# Altium schematic sheet LED Matrix.SchDoc
size A2
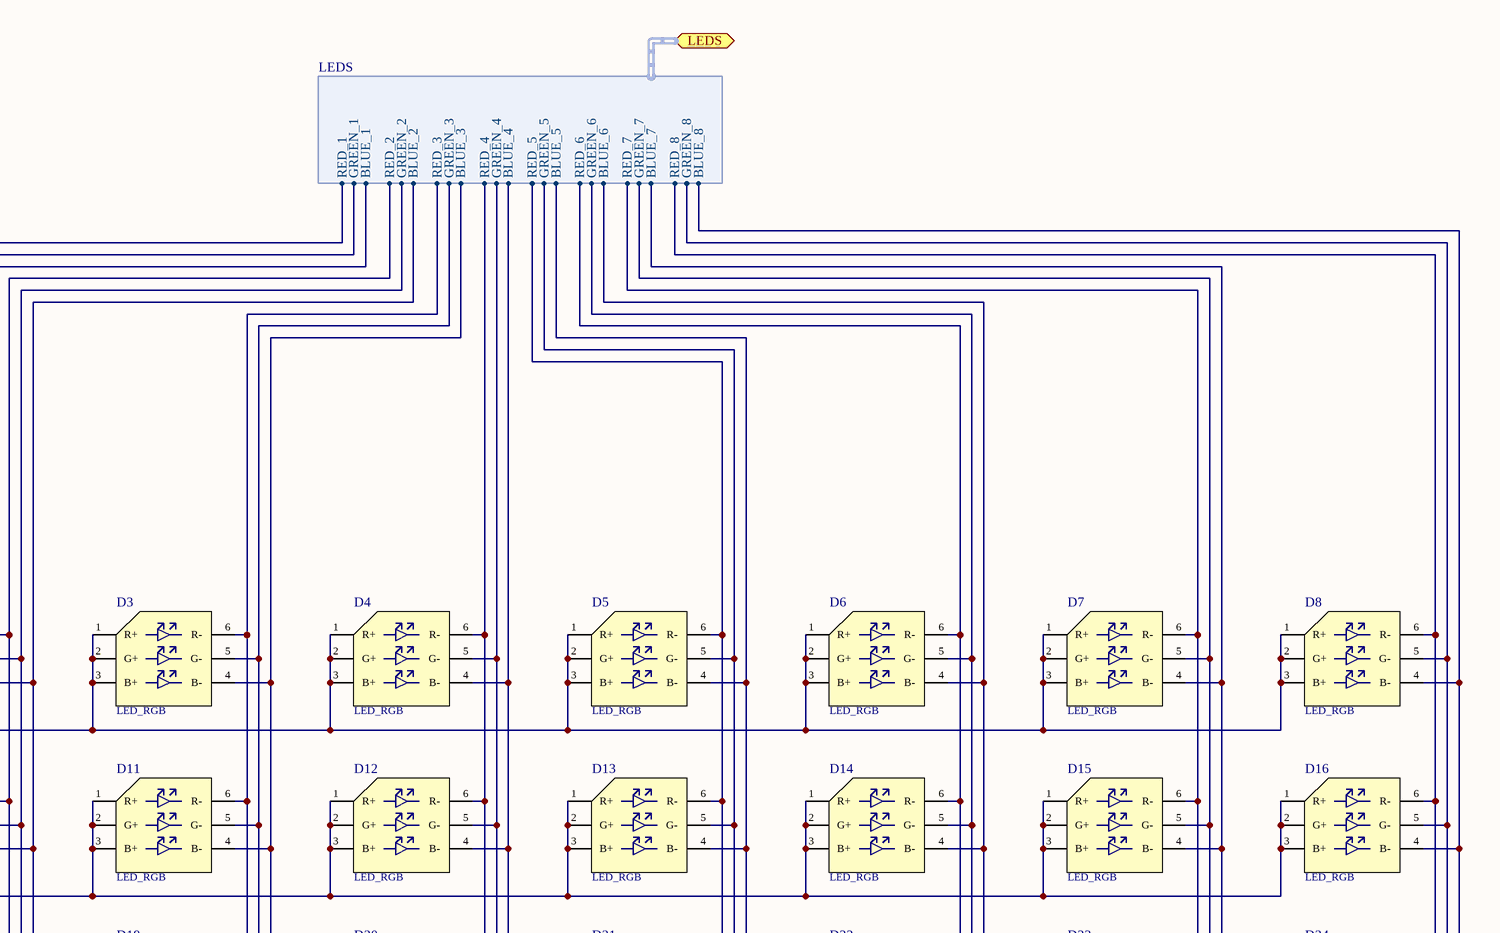
[diagram p0: LED Matrix.SchDoc, top right]
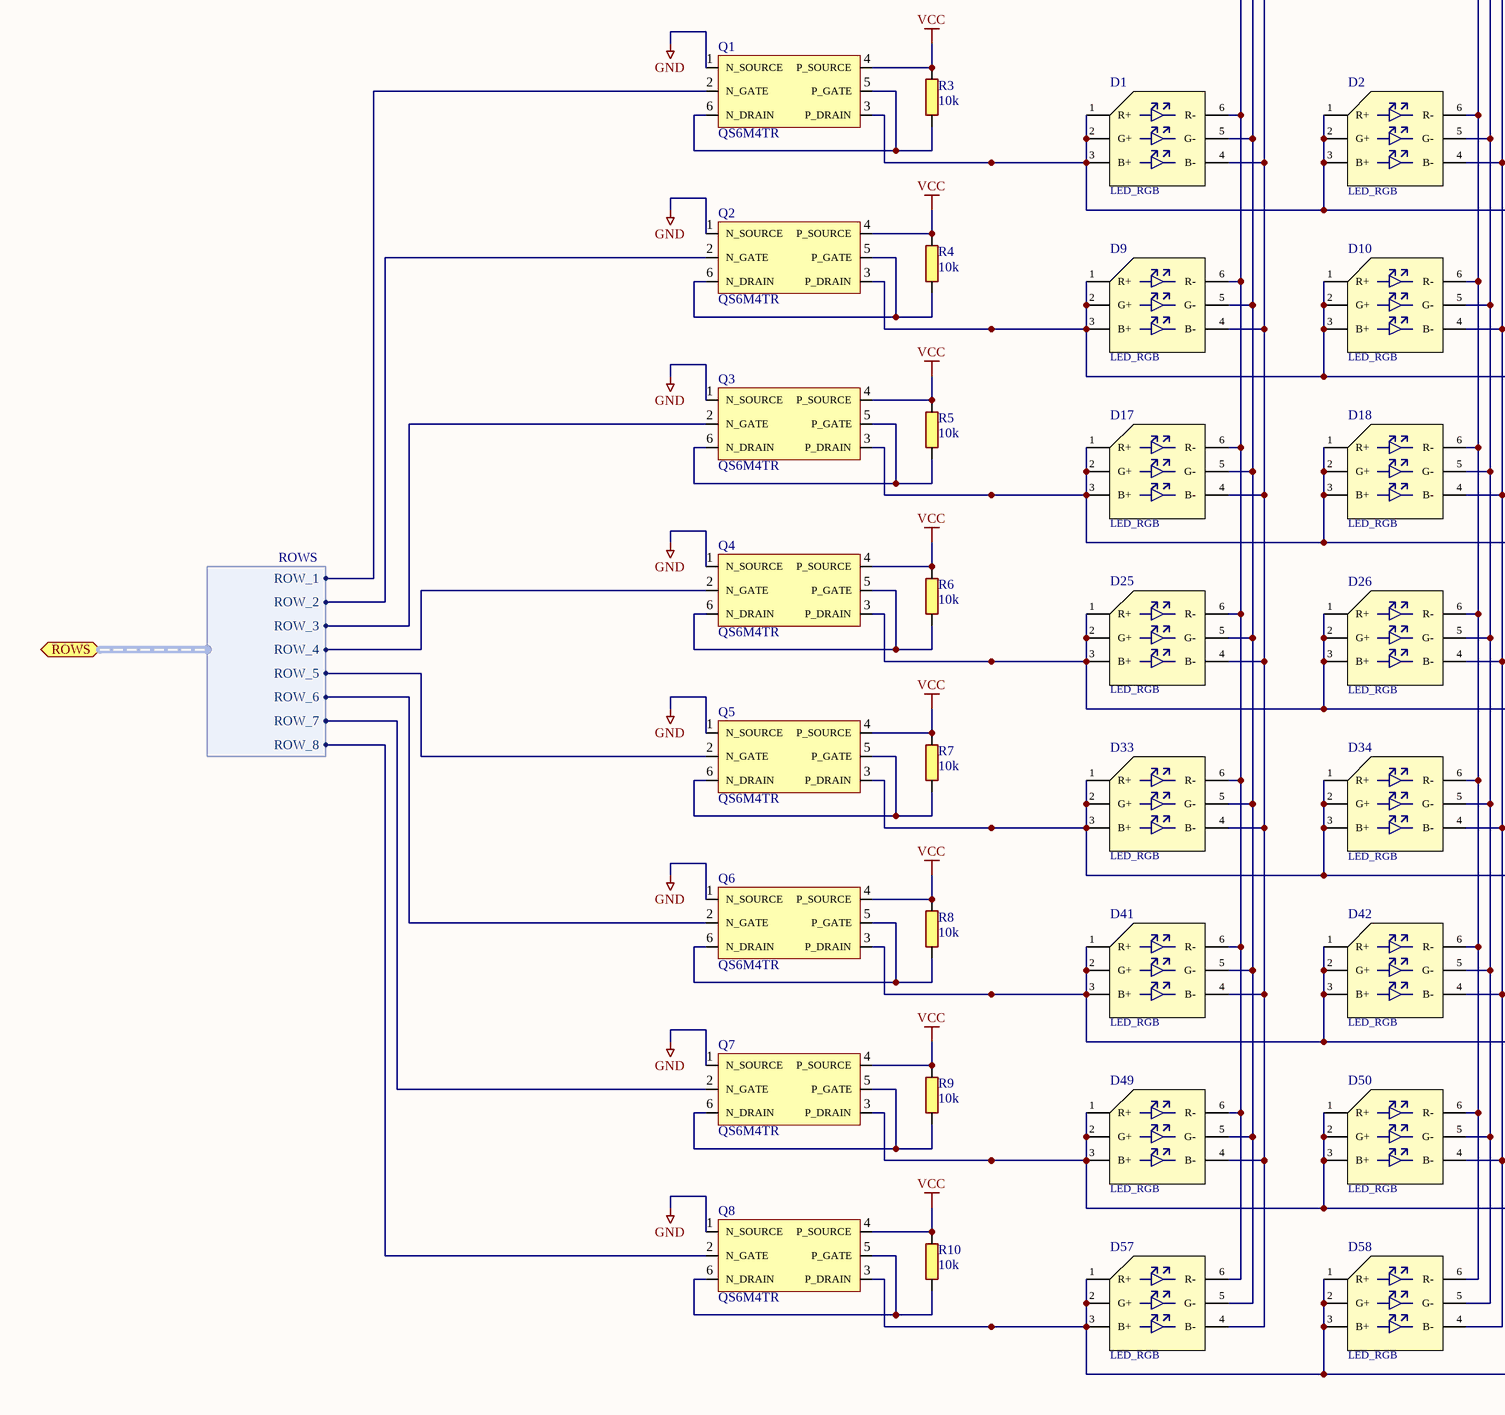
[diagram p1: LED Matrix.SchDoc, bottom left]
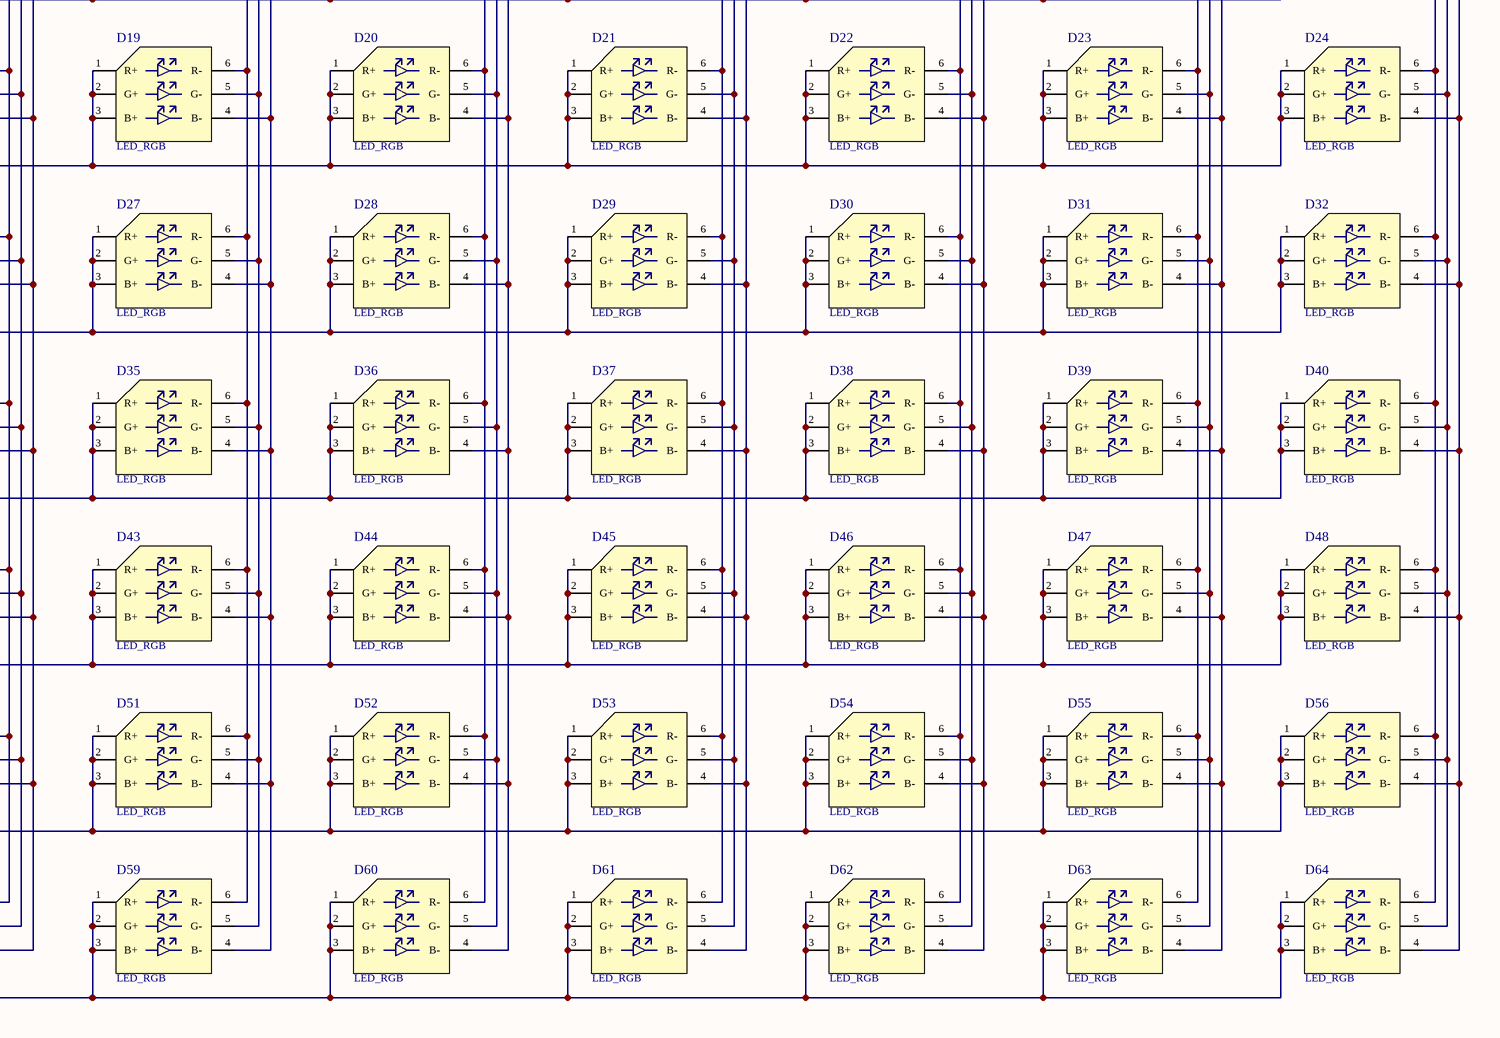
[diagram p2: LED Matrix.SchDoc, bottom right]

## Parts
D1  LED_RGB  [LED5050_RGB_N]
D2  LED_RGB  [LED5050_RGB_N]
D3  LED_RGB  [LED5050_RGB_N]
D4  LED_RGB  [LED5050_RGB_N]
D5  LED_RGB  [LED5050_RGB_N]
D6  LED_RGB  [LED5050_RGB_N]
D7  LED_RGB  [LED5050_RGB_N]
D8  LED_RGB  [LED5050_RGB_N]
D9  LED_RGB  [LED5050_RGB_N]
D10  LED_RGB  [LED5050_RGB_N]
D11  LED_RGB  [LED5050_RGB_N]
D12  LED_RGB  [LED5050_RGB_N]
D13  LED_RGB  [LED5050_RGB_N]
D14  LED_RGB  [LED5050_RGB_N]
D15  LED_RGB  [LED5050_RGB_N]
D16  LED_RGB  [LED5050_RGB_N]
D17  LED_RGB  [LED5050_RGB_N]
D18  LED_RGB  [LED5050_RGB_N]
D19  LED_RGB  [LED5050_RGB_N]
D20  LED_RGB  [LED5050_RGB_N]
D21  LED_RGB  [LED5050_RGB_N]
D22  LED_RGB  [LED5050_RGB_N]
D23  LED_RGB  [LED5050_RGB_N]
D24  LED_RGB  [LED5050_RGB_N]
D25  LED_RGB  [LED5050_RGB_N]
D26  LED_RGB  [LED5050_RGB_N]
D27  LED_RGB  [LED5050_RGB_N]
D28  LED_RGB  [LED5050_RGB_N]
D29  LED_RGB  [LED5050_RGB_N]
D30  LED_RGB  [LED5050_RGB_N]
D31  LED_RGB  [LED5050_RGB_N]
D32  LED_RGB  [LED5050_RGB_N]
D33  LED_RGB  [LED5050_RGB_N]
D34  LED_RGB  [LED5050_RGB_N]
D35  LED_RGB  [LED5050_RGB_N]
D36  LED_RGB  [LED5050_RGB_N]
D37  LED_RGB  [LED5050_RGB_N]
D38  LED_RGB  [LED5050_RGB_N]
D39  LED_RGB  [LED5050_RGB_N]
D40  LED_RGB  [LED5050_RGB_N]
D41  LED_RGB  [LED5050_RGB_N]
D42  LED_RGB  [LED5050_RGB_N]
D43  LED_RGB  [LED5050_RGB_N]
D44  LED_RGB  [LED5050_RGB_N]
D45  LED_RGB  [LED5050_RGB_N]
D46  LED_RGB  [LED5050_RGB_N]
D47  LED_RGB  [LED5050_RGB_N]
D48  LED_RGB  [LED5050_RGB_N]
D49  LED_RGB  [LED5050_RGB_N]
D50  LED_RGB  [LED5050_RGB_N]
D51  LED_RGB  [LED5050_RGB_N]
D52  LED_RGB  [LED5050_RGB_N]
D53  LED_RGB  [LED5050_RGB_N]
D54  LED_RGB  [LED5050_RGB_N]
D55  LED_RGB  [LED5050_RGB_N]
D56  LED_RGB  [LED5050_RGB_N]
D57  LED_RGB  [LED5050_RGB_N]
D58  LED_RGB  [LED5050_RGB_N]
D59  LED_RGB  [LED5050_RGB_N]
D60  LED_RGB  [LED5050_RGB_N]
D61  LED_RGB  [LED5050_RGB_N]
D62  LED_RGB  [LED5050_RGB_N]
D63  LED_RGB  [LED5050_RGB_N]
D64  LED_RGB  [LED5050_RGB_N]
Q1  QS6M4TR
Q2  QS6M4TR
Q3  QS6M4TR
Q4  QS6M4TR
Q5  QS6M4TR
Q6  QS6M4TR
Q7  QS6M4TR
Q8  QS6M4TR
R3  10k  [RESC0603(1608)_N]
R4  10k  [RESC0603(1608)_N]
R5  10k  [RESC0603(1608)_N]
R6  10k  [RESC0603(1608)_N]
R7  10k  [RESC0603(1608)_N]
R8  10k  [RESC0603(1608)_N]
R9  10k  [RESC0603(1608)_N]
R10  10k  [RESC0603(1608)_N]

## Ports
LEDS (harness LEDS), ROWS (harness ROWS)

## Harnesses
LEDS: BLUE_1, BLUE_2, BLUE_3, BLUE_4, BLUE_5, BLUE_6, BLUE_7, GREEN_1, GREEN_2, GREEN_3, GREEN_4, GREEN_5, GREEN_6, GREEN_7, GREEN_8, RED_1, RED_2, RED_3, RED_4, RED_5, RED_6, RED_7, RED_8, BLUE_8
ROWS: ROW_1, ROW_2, ROW_3, ROW_4, ROW_5, ROW_6, ROW_7, ROW_8

## Nets
GND: Q1.1(N_SOURCE) Q2.1(N_SOURCE) Q3.1(N_SOURCE) Q4.1(N_SOURCE) Q5.1(N_SOURCE) Q6.1(N_SOURCE) Q7.1(N_SOURCE) Q8.1(N_SOURCE)
VCC: Q1.4(P_SOURCE) Q2.4(P_SOURCE) Q3.4(P_SOURCE) Q4.4(P_SOURCE) Q5.4(P_SOURCE) Q6.4(P_SOURCE) Q7.4(P_SOURCE) Q8.4(P_SOURCE) R3.2 R4.2 R5.2 R6.2 R7.2 R8.2 R9.2 R10.2
NetD1_1: D1.1(R+) D1.2(G+) D1.3(B+) D2.1(R+) D2.2(G+) D2.3(B+) D3.1(R+) D3.2(G+) D3.3(B+) D4.1(R+) D4.2(G+) D4.3(B+) D5.1(R+) D5.2(G+) D5.3(B+) D6.1(R+) D6.2(G+) D6.3(B+) D7.1(R+) D7.2(G+) D7.3(B+) D8.1(R+) D8.2(G+) D8.3(B+) Q1.3(P_DRAIN)
NetD1_4: D1.4(B-) D9.4(B-) D17.4(B-) D25.4(B-) D33.4(B-) D41.4(B-) D49.4(B-) D57.4(B-) ; port LEDS.BLUE_1
NetD1_5: D1.5(G-) D9.5(G-) D17.5(G-) D25.5(G-) D33.5(G-) D41.5(G-) D49.5(G-) D57.5(G-) ; port LEDS.GREEN_1
NetD1_6: D1.6(R-) D9.6(R-) D17.6(R-) D25.6(R-) D33.6(R-) D41.6(R-) D49.6(R-) D57.6(R-) ; port LEDS.RED_1
NetD2_4: D2.4(B-) D10.4(B-) D18.4(B-) D26.4(B-) D34.4(B-) D42.4(B-) D50.4(B-) D58.4(B-) ; port LEDS.BLUE_2
NetD2_5: D2.5(G-) D10.5(G-) D18.5(G-) D26.5(G-) D34.5(G-) D42.5(G-) D50.5(G-) D58.5(G-) ; port LEDS.GREEN_2
NetD2_6: D2.6(R-) D10.6(R-) D18.6(R-) D26.6(R-) D34.6(R-) D42.6(R-) D50.6(R-) D58.6(R-) ; port LEDS.RED_2
NetD3_4: D3.4(B-) D11.4(B-) D19.4(B-) D27.4(B-) D35.4(B-) D43.4(B-) D51.4(B-) D59.4(B-) ; port LEDS.BLUE_3
NetD3_5: D3.5(G-) D11.5(G-) D19.5(G-) D27.5(G-) D35.5(G-) D43.5(G-) D51.5(G-) D59.5(G-) ; port LEDS.GREEN_3
NetD3_6: D3.6(R-) D11.6(R-) D19.6(R-) D27.6(R-) D35.6(R-) D43.6(R-) D51.6(R-) D59.6(R-) ; port LEDS.RED_3
NetD4_4: D4.4(B-) D12.4(B-) D20.4(B-) D28.4(B-) D36.4(B-) D44.4(B-) D52.4(B-) D60.4(B-) ; port LEDS.BLUE_4
NetD4_5: D4.5(G-) D12.5(G-) D20.5(G-) D28.5(G-) D36.5(G-) D44.5(G-) D52.5(G-) D60.5(G-) ; port LEDS.GREEN_4
NetD4_6: D4.6(R-) D12.6(R-) D20.6(R-) D28.6(R-) D36.6(R-) D44.6(R-) D52.6(R-) D60.6(R-) ; port LEDS.RED_4
NetD5_4: D5.4(B-) D13.4(B-) D21.4(B-) D29.4(B-) D37.4(B-) D45.4(B-) D53.4(B-) D61.4(B-) ; port LEDS.BLUE_5
NetD5_5: D5.5(G-) D13.5(G-) D21.5(G-) D29.5(G-) D37.5(G-) D45.5(G-) D53.5(G-) D61.5(G-) ; port LEDS.GREEN_5
NetD5_6: D5.6(R-) D13.6(R-) D21.6(R-) D29.6(R-) D37.6(R-) D45.6(R-) D53.6(R-) D61.6(R-) ; port LEDS.RED_5
NetD6_4: D6.4(B-) D14.4(B-) D22.4(B-) D30.4(B-) D38.4(B-) D46.4(B-) D54.4(B-) D62.4(B-) ; port LEDS.BLUE_6
NetD6_5: D6.5(G-) D14.5(G-) D22.5(G-) D30.5(G-) D38.5(G-) D46.5(G-) D54.5(G-) D62.5(G-) ; port LEDS.GREEN_6
NetD6_6: D6.6(R-) D14.6(R-) D22.6(R-) D30.6(R-) D38.6(R-) D46.6(R-) D54.6(R-) D62.6(R-) ; port LEDS.RED_6
NetD7_4: D7.4(B-) D15.4(B-) D23.4(B-) D31.4(B-) D39.4(B-) D47.4(B-) D55.4(B-) D63.4(B-) ; port LEDS.BLUE_7
NetD7_5: D7.5(G-) D15.5(G-) D23.5(G-) D31.5(G-) D39.5(G-) D47.5(G-) D55.5(G-) D63.5(G-) ; port LEDS.GREEN_7
NetD7_6: D7.6(R-) D15.6(R-) D23.6(R-) D31.6(R-) D39.6(R-) D47.6(R-) D55.6(R-) D63.6(R-) ; port LEDS.RED_7
NetD8_4: D8.4(B-) D16.4(B-) D24.4(B-) D32.4(B-) D40.4(B-) D48.4(B-) D56.4(B-) D64.4(B-) ; port LEDS.BLUE_8
NetD8_5: D8.5(G-) D16.5(G-) D24.5(G-) D32.5(G-) D40.5(G-) D48.5(G-) D56.5(G-) D64.5(G-) ; port LEDS.GREEN_8
NetD8_6: D8.6(R-) D16.6(R-) D24.6(R-) D32.6(R-) D40.6(R-) D48.6(R-) D56.6(R-) D64.6(R-) ; port LEDS.RED_8
NetD9_1: D9.1(R+) D9.2(G+) D9.3(B+) D10.1(R+) D10.2(G+) D10.3(B+) D11.1(R+) D11.2(G+) D11.3(B+) D12.1(R+) D12.2(G+) D12.3(B+) D13.1(R+) D13.2(G+) D13.3(B+) D14.1(R+) D14.2(G+) D14.3(B+) D15.1(R+) D15.2(G+) D15.3(B+) D16.1(R+) D16.2(G+) D16.3(B+) Q2.3(P_DRAIN)
NetD17_1: D17.1(R+) D17.2(G+) D17.3(B+) D18.1(R+) D18.2(G+) D18.3(B+) D19.1(R+) D19.2(G+) D19.3(B+) D20.1(R+) D20.2(G+) D20.3(B+) D21.1(R+) D21.2(G+) D21.3(B+) D22.1(R+) D22.2(G+) D22.3(B+) D23.1(R+) D23.2(G+) D23.3(B+) D24.1(R+) D24.2(G+) D24.3(B+) Q3.3(P_DRAIN)
NetD25_1: D25.1(R+) D25.2(G+) D25.3(B+) D26.1(R+) D26.2(G+) D26.3(B+) D27.1(R+) D27.2(G+) D27.3(B+) D28.1(R+) D28.2(G+) D28.3(B+) D29.1(R+) D29.2(G+) D29.3(B+) D30.1(R+) D30.2(G+) D30.3(B+) D31.1(R+) D31.2(G+) D31.3(B+) D32.1(R+) D32.2(G+) D32.3(B+) Q4.3(P_DRAIN)
NetD33_1: D33.1(R+) D33.2(G+) D33.3(B+) D34.1(R+) D34.2(G+) D34.3(B+) D35.1(R+) D35.2(G+) D35.3(B+) D36.1(R+) D36.2(G+) D36.3(B+) D37.1(R+) D37.2(G+) D37.3(B+) D38.1(R+) D38.2(G+) D38.3(B+) D39.1(R+) D39.2(G+) D39.3(B+) D40.1(R+) D40.2(G+) D40.3(B+) Q5.3(P_DRAIN)
NetD41_1: D41.1(R+) D41.2(G+) D41.3(B+) D42.1(R+) D42.2(G+) D42.3(B+) D43.1(R+) D43.2(G+) D43.3(B+) D44.1(R+) D44.2(G+) D44.3(B+) D45.1(R+) D45.2(G+) D45.3(B+) D46.1(R+) D46.2(G+) D46.3(B+) D47.1(R+) D47.2(G+) D47.3(B+) D48.1(R+) D48.2(G+) D48.3(B+) Q6.3(P_DRAIN)
NetD49_1: D49.1(R+) D49.2(G+) D49.3(B+) D50.1(R+) D50.2(G+) D50.3(B+) D51.1(R+) D51.2(G+) D51.3(B+) D52.1(R+) D52.2(G+) D52.3(B+) D53.1(R+) D53.2(G+) D53.3(B+) D54.1(R+) D54.2(G+) D54.3(B+) D55.1(R+) D55.2(G+) D55.3(B+) D56.1(R+) D56.2(G+) D56.3(B+) Q7.3(P_DRAIN)
NetD57_1: D57.1(R+) D57.2(G+) D57.3(B+) D58.1(R+) D58.2(G+) D58.3(B+) D59.1(R+) D59.2(G+) D59.3(B+) D60.1(R+) D60.2(G+) D60.3(B+) D61.1(R+) D61.2(G+) D61.3(B+) D62.1(R+) D62.2(G+) D62.3(B+) D63.1(R+) D63.2(G+) D63.3(B+) D64.1(R+) D64.2(G+) D64.3(B+) Q8.3(P_DRAIN)
NetQ1_2: Q1.2(N_GATE) ; port ROWS.ROW_1
NetQ1_5: Q1.5(P_GATE) Q1.6(N_DRAIN) R3.1
NetQ2_2: Q2.2(N_GATE) ; port ROWS.ROW_2
NetQ2_5: Q2.5(P_GATE) Q2.6(N_DRAIN) R4.1
NetQ3_2: Q3.2(N_GATE) ; port ROWS.ROW_3
NetQ3_5: Q3.5(P_GATE) Q3.6(N_DRAIN) R5.1
NetQ4_2: Q4.2(N_GATE) ; port ROWS.ROW_4
NetQ4_5: Q4.5(P_GATE) Q4.6(N_DRAIN) R6.1
NetQ5_2: Q5.2(N_GATE) ; port ROWS.ROW_5
NetQ5_5: Q5.5(P_GATE) Q5.6(N_DRAIN) R7.1
NetQ6_2: Q6.2(N_GATE) ; port ROWS.ROW_6
NetQ6_5: Q6.5(P_GATE) Q6.6(N_DRAIN) R8.1
NetQ7_2: Q7.2(N_GATE) ; port ROWS.ROW_7
NetQ7_5: Q7.5(P_GATE) Q7.6(N_DRAIN) R9.1
NetQ8_2: Q8.2(N_GATE) ; port ROWS.ROW_8
NetQ8_5: Q8.5(P_GATE) Q8.6(N_DRAIN) R10.1

## Library data of the parts
D1-D64 = 3348: LED RGB, independent colors; id: 3348; rad: 7; rom: OV; lager_type: Fremlager; dybde: 0; hylle: 6; antall: 300; pakke_opprettet_av: 924; beskrivelse: SMD; navn: LED RGB; pris: 1; kolonne: 0; pakke_opprettet: 12/17/2015 2:22:54 AM; symbol_opprettet_av: 924; symbol_opprettet: 12/17/2015 2:22:13 AM; pakketype: SMD
R3-R10 = 2444: 0.1W 1% Thick film resistor; id: 2444; rad: -1; rom: OV; lager_type: Fremlager; dybde: 72; hylle: 6; antall: 90; kolonne: 0; pakke_opprettet_av: 815; leverandor_varenr: 2447230; nokkelord: Resistor Motstand; produsent: Multikomp; leverandor: Farnell; pakketype: 0603; pakke_opprettet: 08-Jul-14 9:15:30 PM; symbol_opprettet_av: 815; symbol_opprettet: 08-Jul-14 9:16:33 PM; navn: 10k; pris: 0